# Altium project BattPro_InLine.PrjPCB
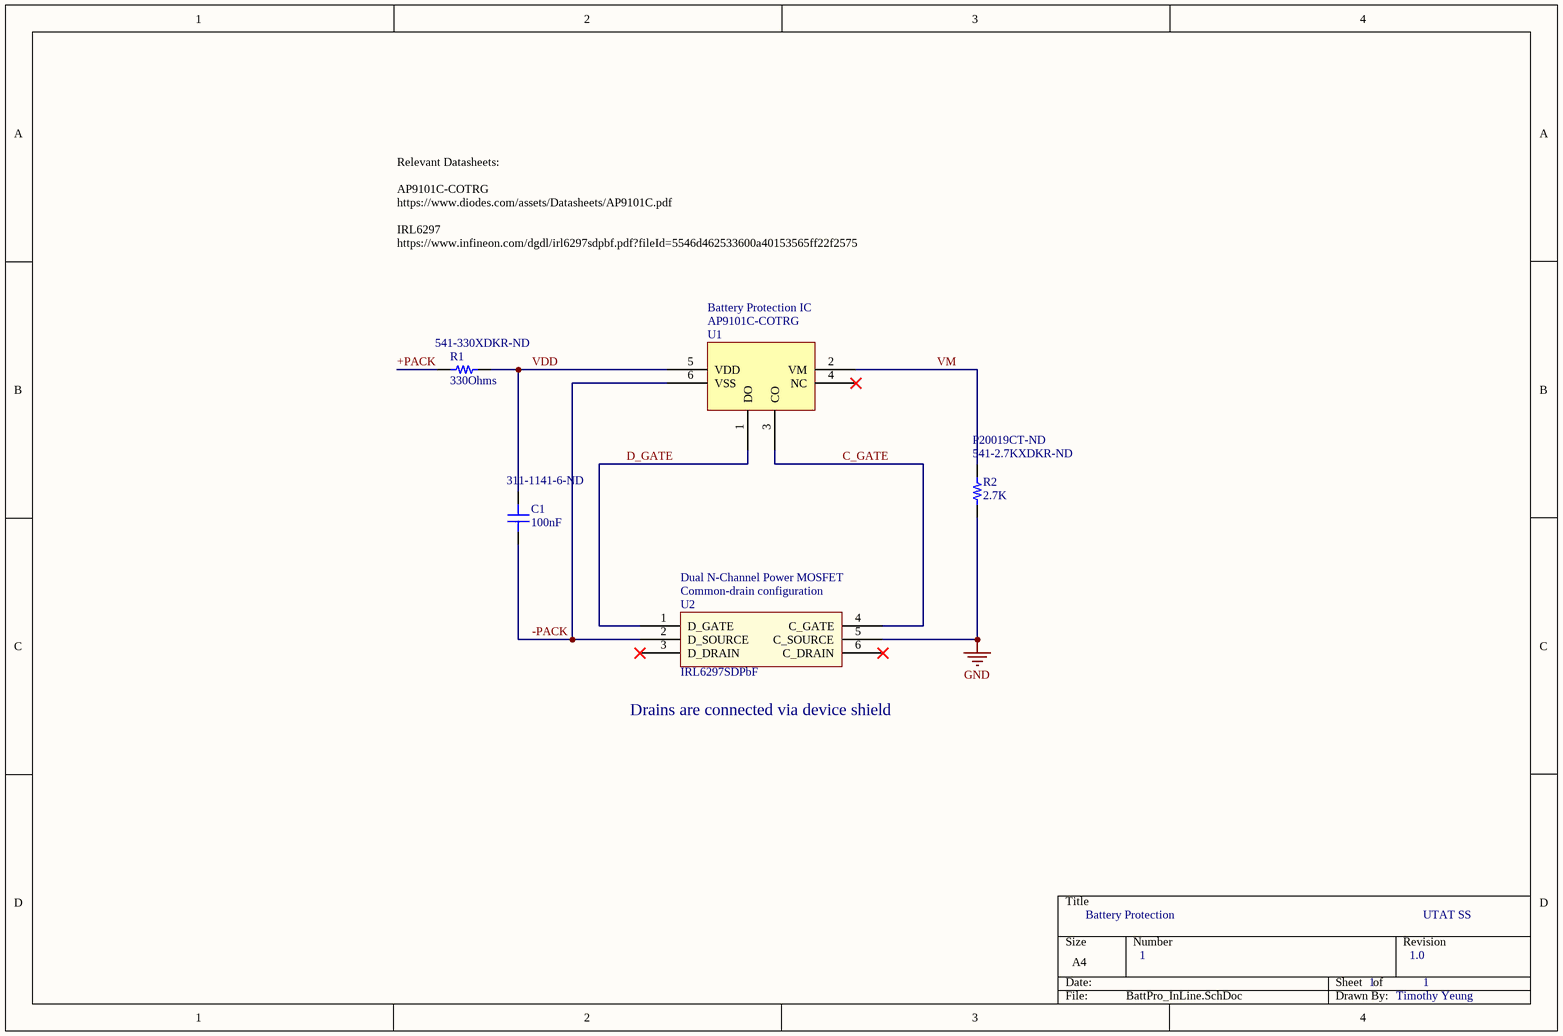
[diagram p0: BattPro_InLine.SchDoc]
1 sheet, 5 parts. Net scope: global (net labels, ports and power ports of the same name join across sheets).
Board file: BattPro_InLine.PcbDoc

## Sheet BattPro_InLine.SchDoc
size A4

### Parts
C1  100nF  Supplier Part Number 1: 311-1141-6-ND  [CAP0402R]
R1  330Ohms  Supplier Part Number 1: 541-330XDKR-ND  [RES0402R]
R2  2.7K  Supplier Part Number 1: 541-2.7KXDKR-ND  Supplier Part Number 2: P20019CT-ND  [RES0402R]
U1  AP9101C-COTRG  [SOT-26]
U2  IRL6297SDPbF  [IRL6297SDPbF]

### Nets
GND: R2.1 U2.5(C_SOURCE)
+PACK: R1.1
-PACK: C1.1 U1.6(VSS) U2.2(D_SOURCE)
C_GATE: U1.3(CO) U2.4(C_GATE)
D_GATE: U1.1(DO) U2.1(D_GATE)
VDD: C1.2 R1.2 U1.5(VDD)
VM: R2.2 U1.2(VM)

Not connected (* = marked no-connect by the designer): U1 4(NC)*; U2 3(D_DRAIN)* 6(C_DRAIN)*

### Notes on the sheet
- Relevant Datasheets:
  AP9101C-COTRG
  https://www.diodes.com/assets/Datasheets/AP9101C.pdf
  IRL6297
  https://www.infineon.com/dgdl/irl6297sdpbf.pdf?fileId=5546d462533600a40153565ff22f2575
- Battery Protection IC
- (near U2) Dual N-Channel Power MOSFET
- (near U2) Common-drain configuration
- (near U2) Drains are connected via device shield
- Battery Protection
- UTAT SS
- 1
- 1.0
- Timothy Yeung

### Library data of the parts
C1 = Capacitor: SMT Capacitor; Manufacturer: Yageo; Manufacturer Part Number: CC0805KRX7R8BB104; Value: 0.1uF; Material: Ceramic; Voltage Rating: 25V; Tolerance: 10%; Dielectric: X7R; Insulation Resistance: 100GR; Supplier 1: Digi-Key; Stock 1: 1166693; Pricing 1: 1=0.13, 10=0.092, 100=0.0433, 500=0.0304, 1000=0.02516 (USD); Mount: Surface Mount; Case/Package: 0805; Number of Pins: 2; Case Code (Metric): 2012; Case Code (Imperial): 0805; Min Operating Temperature: -55°C; Max Operating Temperature: 125°C; Package Quantity: 1; Capacitance: 100nF; Packaging: Tape and Reel; Voltage Rating (DC): 25V; Termination: SMD/SMT; Composition: Ceramic; Length: 2mm; Height: 0.85mm; Width: 0.049inch; Thickness: 0.033inch; Depth: 1.25mm; Radiation Hardening: No; REACH SVHC: No SVHC; Lead Free: Lead Free; Halogen Free: Halogen Free; ComponentLink1URL: http://www.yageo.com/documents/recent/UPY-GPHC_X7R_6.3V-to-50V_18.pdf?src-supplier=Digi-Key; ComponentLink1Description: http://www.yageo.com/documents/recent/UPY-GPHC_X7R_6.3V-to-50V_18.pdf?src-supplier=Digi-Key; ComponentLink2URL: http://www.farnell.com/datasheets/1489800.pdf?src-supplier=Element14; ComponentLink2Description: http://www.farnell.com/datasheets/1489800.pdf?src-supplier=Element14; ComponentLink3URL: http://www.farnell.com/datasheets/1850775.pdf?src-supplier=Element14; ComponentLink3Description: http://www.farnell.com/datasheets/1850775.pdf?src-supplier=Element14; ComponentLink4URL: https://www.verical.com/server-webapp/html/getDatasheet?partID=330244&src-supplier=Verical; ComponentLink4Description: https://www.verical.com/server-webapp/html/getDatasheet?partID=330244&src-supplier=Verical; ComponentLink5URL: http://www.yageo.com/documents/recent/UPY-GPHC_X7R_6.3V-to-50V_8.pdf?src-supplier=Avnet+Europe; ComponentLink5Description: http://www.yageo.com/documents/recent/UPY-GPHC_X7R_6.3V-to-50V_8.pdf?src-supplier=Avnet+Europe; ComponentLink6URL: http://www.farnell.com/datasheets/1784427.pdf?src-supplier=Element14; ComponentLink6Description: http://www.farnell.com/datasheets/1784427.pdf?src-supplier=Element14; ComponentLink7URL: http://www.farnell.com/datasheets/70765.pdf?src-supplier=Element14; ComponentLink7Description: http://www.farnell.com/datasheets/70765.pdf?src-supplier=Element14
R1 = Resistor: SMT Resistor; Manufacturer: Vishay Dale; Manufacturer Part Number: CRCW2512330RJNEG; Value: 1K; Resistance: 330R; Tolerance: 5%; Power Rating: 1W; Voltage Rating: 500V; Temperature Coefficient: 200ppm/°C; Supplier 1: Digi-Key; Stock 1: 42562; Pricing 1: 1=0.38, 10=0.318, 100=0.1242, 1000=0.05198 (USD); Mount: Surface Mount; Case/Package: 2512; Number of Pins: 2; Weight: 0.001429oz; Case Code (Metric): 6432; Case Code (Imperial): 2512; Contact Plating: Tin; Min Operating Temperature: -55°C; Max Operating Temperature: 155°C; Package Quantity: 1; Packaging: Tape and Reel; Composition: Thick Film; Number of Terminations: 2; Military Standard: Not; Termination: Solder; Max Power Dissipation: 1W; Voltage Rating (DC): 500V; Features: Automotive AEC-Q200; Length: 6.3mm; Height: 0.6mm; Width: 0.124inch; Depth: 3.15mm; Radiation Hardening: No; REACH SVHC: Unknown; Lead Free: Lead Free; ComponentLink1URL: http://www.vishay.com/docs/20035/dcrcwe3.pdf?src-supplier=Digi-Key; ComponentLink1Description: http://www.vishay.com/docs/20035/dcrcwe3.pdf?src-supplier=Digi-Key; ComponentLink2URL: http://www.vishay.com/docs/20035/dcrcwe3.pdf?src-supplier=Avnet; ComponentLink2Description: http://www.vishay.com/docs/20035/dcrcwe3.pdf?src-supplier=Avnet; ComponentLink3URL: https://www.alliedelec.com/m/d/0c934d6939ccefa68dbe0b96d821c8cf.pdf?src-supplier=Allied+Electronics; ComponentLink3Description: https://www.alliedelec.com/m/d/0c934d6939ccefa68dbe0b96d821c8cf.pdf?src-supplier=Allied+Electronics; ComponentLink4URL: http://www.vishay.com/docs/20035/dcrcwe3.pdf?src-supplier=Future+Electronics; ComponentLink4Description: http://www.vishay.com/docs/20035/dcrcwe3.pdf?src-supplier=Future+Electronics; ComponentLink5URL: http://www.farnell.com/datasheets/1847332.pdf?src-supplier=Element14; ComponentLink5Description: http://www.farnell.com/datasheets/1847332.pdf?src-supplier=Element14; ComponentLink6URL: http://www.mouser.com/ds/2/427/dcrcwe3-109170.pdf?src-supplier=Mouser; ComponentLink6Description: http://www.mouser.com/ds/2/427/dcrcwe3-109170.pdf?src-supplier=Mouser
R2 = Resistor: SMT Resistor; Manufacturer: Vishay Dale; Manufacturer Part Number: CRCW25122K70JNEG; Value: 1K; Tolerance: 5%; Power Rating: 1W; Voltage Rating: 500V; Resistance: 2.7kR; Temperature Coefficient: 200ppm/°C; Supplier 1: Digi-Key; Stock 1: 6589; Pricing 1: 1=0.38, 10=0.318, 100=0.1242, 1000=0.05198 (USD); Case/Package: 2512; Number of Pins: 2; Weight: 0.001429oz; Case Code (Imperial): 2512; Case Code (Metric): 6432; Contact Plating: Tin; Min Operating Temperature: -55°C; Max Operating Temperature: 155°C; Packaging: Tape and Reel; Package Quantity: 2000; Termination: SMD/SMT; Composition: Thick Film; Number of Terminations: 2; Military Standard: Not; Max Power Dissipation: 1W; Voltage Rating (DC): 500V; Features: Automotive AEC-Q200; Length: 6.3mm; Height: 0.028inch; Width: 3.15mm; Depth: 3.15mm; Radiation Hardening: No; Lead Free: Lead Free; REACH SVHC: Unknown; ComponentLink1URL: http://www.mouser.com/ds/2/427/dcrcwe3-109170.pdf?src-supplier=Mouser; ComponentLink1Description: http://www.mouser.com/ds/2/427/dcrcwe3-109170.pdf?src-supplier=Mouser; ComponentLink2URL: http://www.vishay.com/docs/20035/dcrcwe3.pdf?src-supplier=Avnet; ComponentLink2Description: http://www.vishay.com/docs/20035/dcrcwe3.pdf?src-supplier=Avnet; ComponentLink3URL: http://www.farnell.com/datasheets/2045674.pdf?src-supplier=Element14; ComponentLink3Description: http://www.farnell.com/datasheets/2045674.pdf?src-supplier=Element14; ComponentLink4URL: http://www.vishay.com/docs/20035/dcrcwe3.pdf?src-supplier=Digi-Key; ComponentLink4Description: http://www.vishay.com/docs/20035/dcrcwe3.pdf?src-supplier=Digi-Key; Supplier 2: Digi-Key; Stock 2: 1266; Pricing 2: 1=0.25, 10=0.211, 25=0.1532, 50=0.111, 100=0.0823, 250=0.06316, 500=0.04976, 1000=0.03445 (USD); Height - Seated (Max): 0.022inch
U1 = AP9101C-COTRG: Battery Protection IC
U2 = IRL6297SDPbF: Supplier 1: Digi-Key; Supplier Part Number 1: IRL6297SDTRPBF-ND